# EasyEDA schematic 1-Schematic_Activity_Tracker.json
TITLE: Activity Tracker; REV: 1.0; Date: 2024-11-10; Sheet: 1/1; Drawn By: Nick Jarnot; Company: JarnoTech
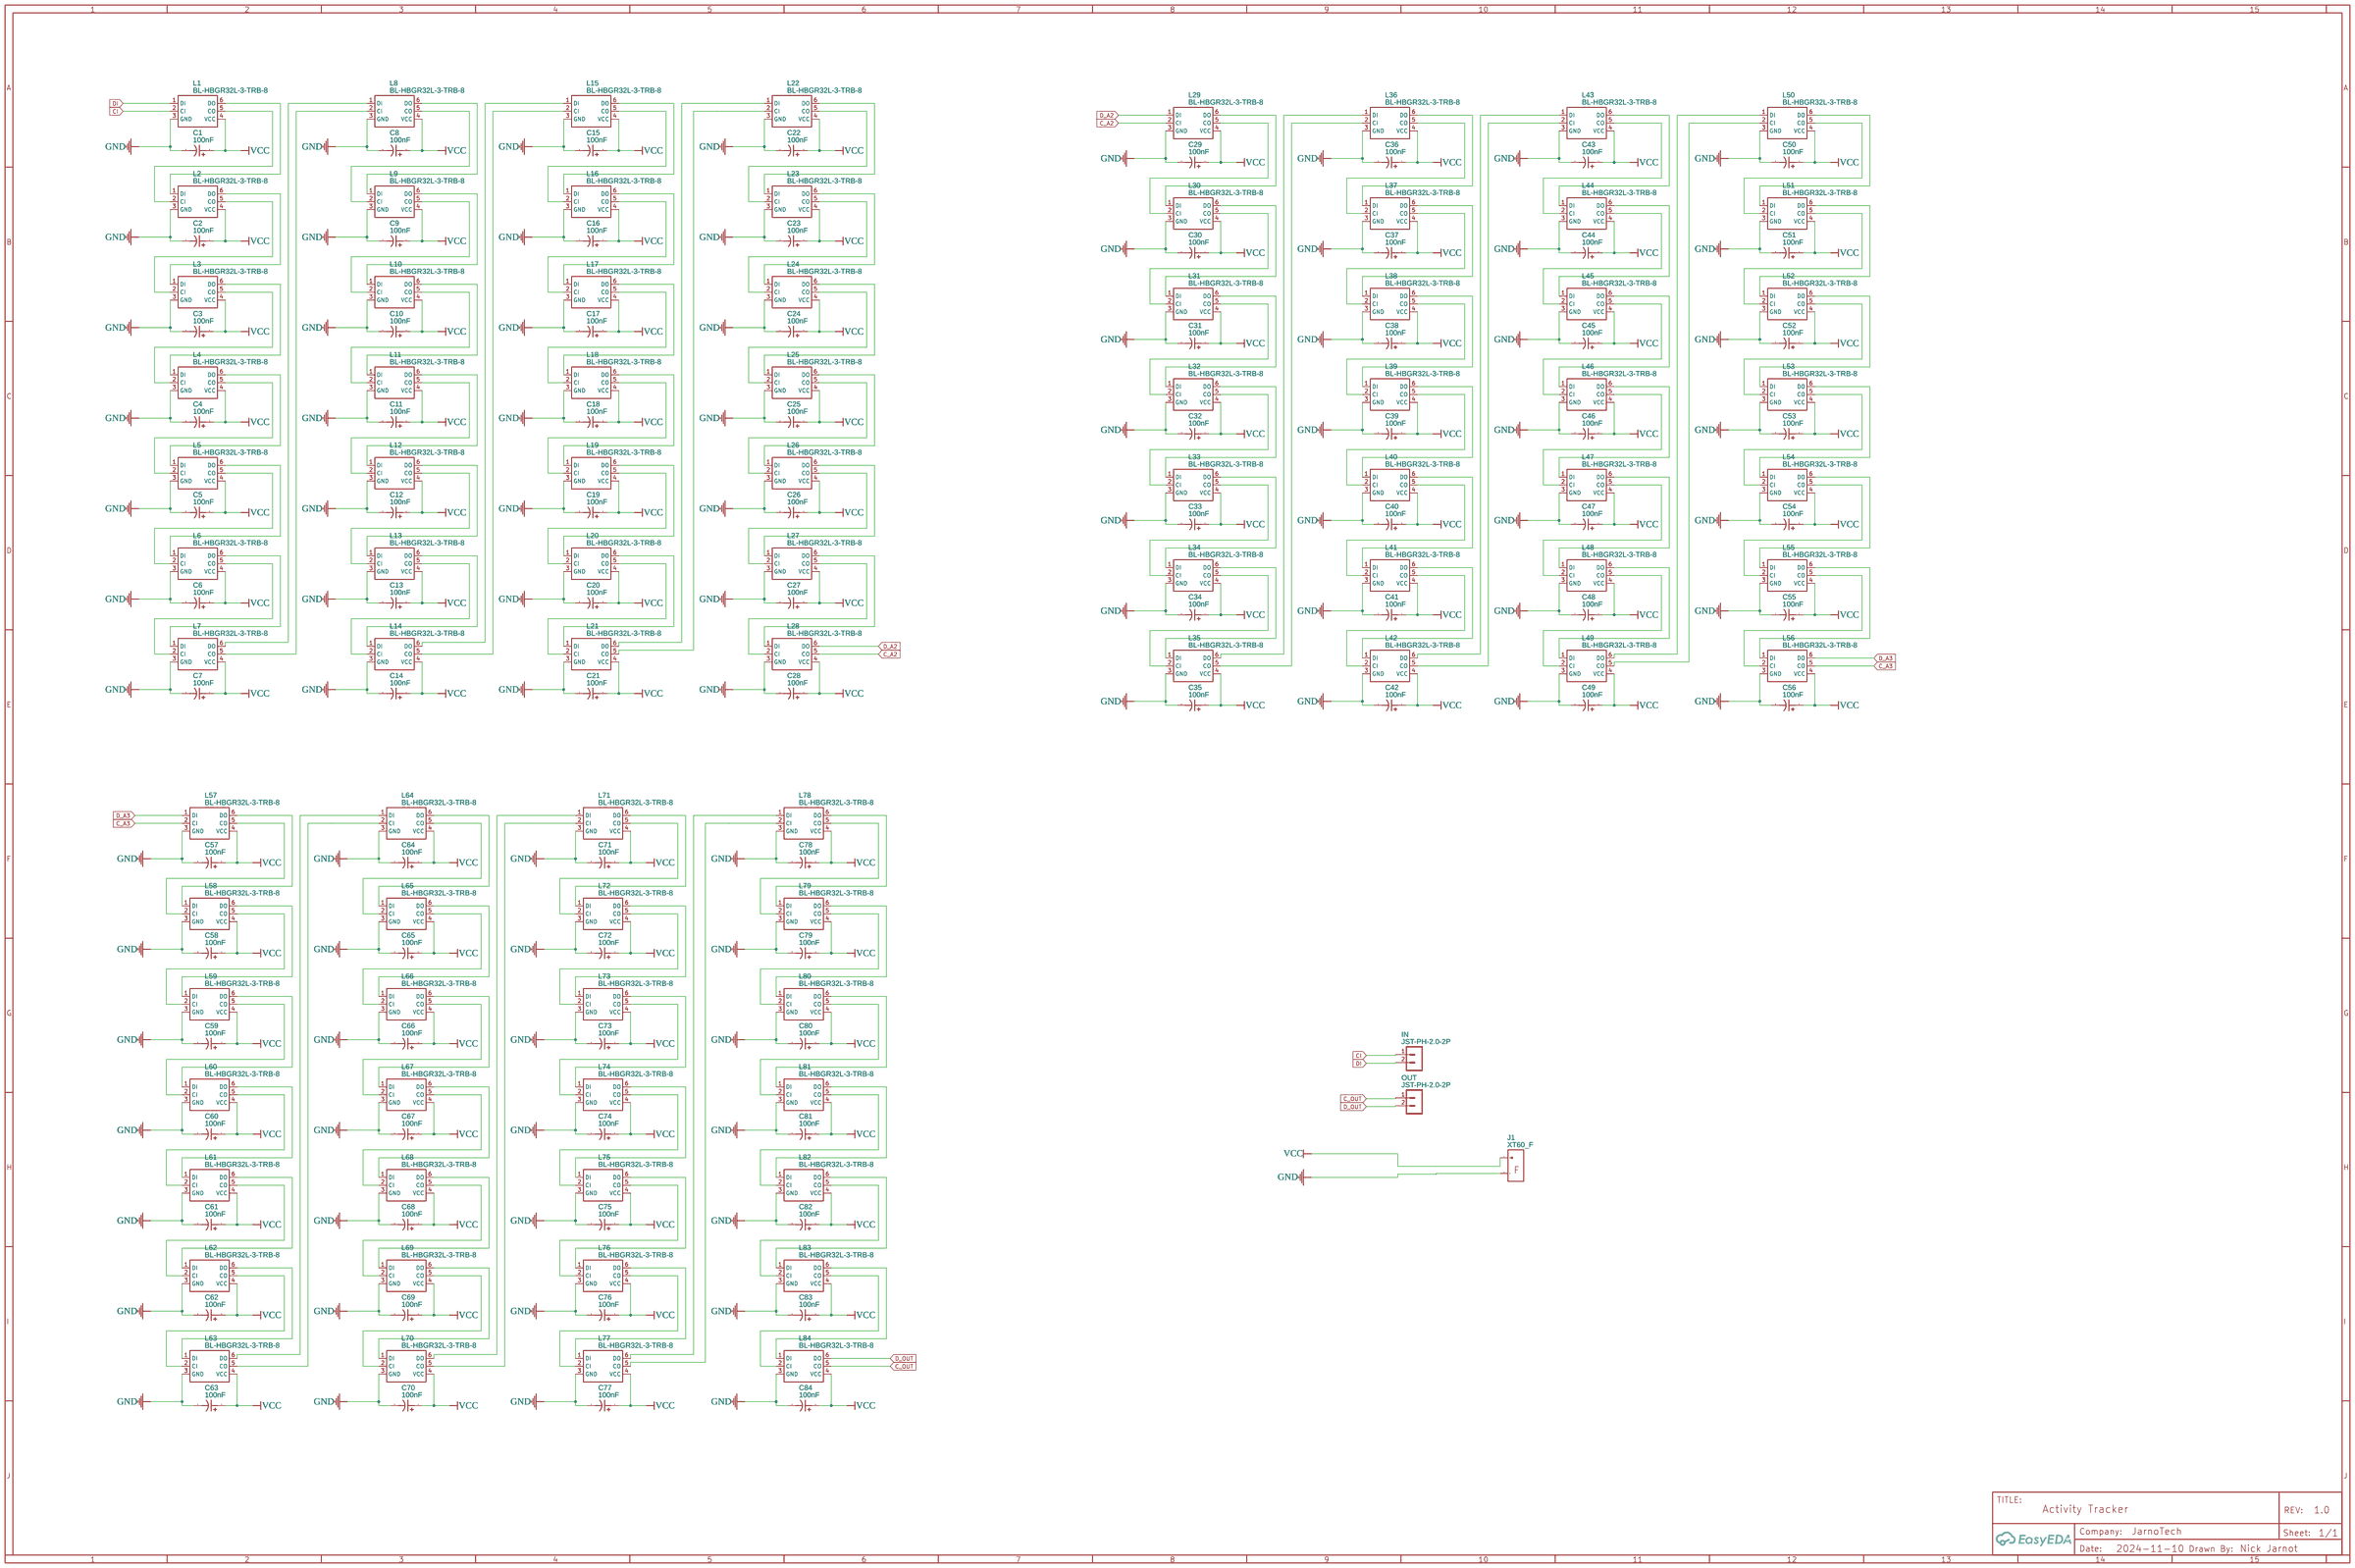
[diagram p0: schematic sheet]

## Parts
C1  100nF  [CAP-SMD_L3.2-W1.6-FD-1]
C2  100nF  [CAP-SMD_L3.2-W1.6-FD-1]
C3  100nF  [CAP-SMD_L3.2-W1.6-FD-1]
C4  100nF  [CAP-SMD_L3.2-W1.6-FD-1]
C5  100nF  [CAP-SMD_L3.2-W1.6-FD-1]
C6  100nF  [CAP-SMD_L3.2-W1.6-FD-1]
C7  100nF  [CAP-SMD_L3.2-W1.6-FD-1]
C8  100nF  [CAP-SMD_L3.2-W1.6-FD-1]
C9  100nF  [CAP-SMD_L3.2-W1.6-FD-1]
C10  100nF  [CAP-SMD_L3.2-W1.6-FD-1]
C11  100nF  [CAP-SMD_L3.2-W1.6-FD-1]
C12  100nF  [CAP-SMD_L3.2-W1.6-FD-1]
C13  100nF  [CAP-SMD_L3.2-W1.6-FD-1]
C14  100nF  [CAP-SMD_L3.2-W1.6-FD-1]
C15  100nF  [CAP-SMD_L3.2-W1.6-FD-1]
C16  100nF  [CAP-SMD_L3.2-W1.6-FD-1]
C17  100nF  [CAP-SMD_L3.2-W1.6-FD-1]
C18  100nF  [CAP-SMD_L3.2-W1.6-FD-1]
C19  100nF  [CAP-SMD_L3.2-W1.6-FD-1]
C20  100nF  [CAP-SMD_L3.2-W1.6-FD-1]
C21  100nF  [CAP-SMD_L3.2-W1.6-FD-1]
C22  100nF  [CAP-SMD_L3.2-W1.6-FD-1]
C23  100nF  [CAP-SMD_L3.2-W1.6-FD-1]
C24  100nF  [CAP-SMD_L3.2-W1.6-FD-1]
C25  100nF  [CAP-SMD_L3.2-W1.6-FD-1]
C26  100nF  [CAP-SMD_L3.2-W1.6-FD-1]
C27  100nF  [CAP-SMD_L3.2-W1.6-FD-1]
C28  100nF  [CAP-SMD_L3.2-W1.6-FD-1]
C29  100nF  [CAP-SMD_L3.2-W1.6-FD-1]
C30  100nF  [CAP-SMD_L3.2-W1.6-FD-1]
C31  100nF  [CAP-SMD_L3.2-W1.6-FD-1]
C32  100nF  [CAP-SMD_L3.2-W1.6-FD-1]
C33  100nF  [CAP-SMD_L3.2-W1.6-FD-1]
C34  100nF  [CAP-SMD_L3.2-W1.6-FD-1]
C35  100nF  [CAP-SMD_L3.2-W1.6-FD-1]
C36  100nF  [CAP-SMD_L3.2-W1.6-FD-1]
C37  100nF  [CAP-SMD_L3.2-W1.6-FD-1]
C38  100nF  [CAP-SMD_L3.2-W1.6-FD-1]
C39  100nF  [CAP-SMD_L3.2-W1.6-FD-1]
C40  100nF  [CAP-SMD_L3.2-W1.6-FD-1]
C41  100nF  [CAP-SMD_L3.2-W1.6-FD-1]
C42  100nF  [CAP-SMD_L3.2-W1.6-FD-1]
C43  100nF  [CAP-SMD_L3.2-W1.6-FD-1]
C44  100nF  [CAP-SMD_L3.2-W1.6-FD-1]
C45  100nF  [CAP-SMD_L3.2-W1.6-FD-1]
C46  100nF  [CAP-SMD_L3.2-W1.6-FD-1]
C47  100nF  [CAP-SMD_L3.2-W1.6-FD-1]
C48  100nF  [CAP-SMD_L3.2-W1.6-FD-1]
C49  100nF  [CAP-SMD_L3.2-W1.6-FD-1]
C50  100nF  [CAP-SMD_L3.2-W1.6-FD-1]
C51  100nF  [CAP-SMD_L3.2-W1.6-FD-1]
C52  100nF  [CAP-SMD_L3.2-W1.6-FD-1]
C53  100nF  [CAP-SMD_L3.2-W1.6-FD-1]
C54  100nF  [CAP-SMD_L3.2-W1.6-FD-1]
C55  100nF  [CAP-SMD_L3.2-W1.6-FD-1]
C56  100nF  [CAP-SMD_L3.2-W1.6-FD-1]
C57  100nF  [CAP-SMD_L3.2-W1.6-FD-1]
C58  100nF  [CAP-SMD_L3.2-W1.6-FD-1]
C59  100nF  [CAP-SMD_L3.2-W1.6-FD-1]
C60  100nF  [CAP-SMD_L3.2-W1.6-FD-1]
C61  100nF  [CAP-SMD_L3.2-W1.6-FD-1]
C62  100nF  [CAP-SMD_L3.2-W1.6-FD-1]
C63  100nF  [CAP-SMD_L3.2-W1.6-FD-1]
C64  100nF  [CAP-SMD_L3.2-W1.6-FD-1]
C65  100nF  [CAP-SMD_L3.2-W1.6-FD-1]
C66  100nF  [CAP-SMD_L3.2-W1.6-FD-1]
C67  100nF  [CAP-SMD_L3.2-W1.6-FD-1]
C68  100nF  [CAP-SMD_L3.2-W1.6-FD-1]
C69  100nF  [CAP-SMD_L3.2-W1.6-FD-1]
C70  100nF  [CAP-SMD_L3.2-W1.6-FD-1]
C71  100nF  [CAP-SMD_L3.2-W1.6-FD-1]
C72  100nF  [CAP-SMD_L3.2-W1.6-FD-1]
C73  100nF  [CAP-SMD_L3.2-W1.6-FD-1]
C74  100nF  [CAP-SMD_L3.2-W1.6-FD-1]
C75  100nF  [CAP-SMD_L3.2-W1.6-FD-1]
C76  100nF  [CAP-SMD_L3.2-W1.6-FD-1]
C77  100nF  [CAP-SMD_L3.2-W1.6-FD-1]
C78  100nF  [CAP-SMD_L3.2-W1.6-FD-1]
C79  100nF  [CAP-SMD_L3.2-W1.6-FD-1]
C80  100nF  [CAP-SMD_L3.2-W1.6-FD-1]
C81  100nF  [CAP-SMD_L3.2-W1.6-FD-1]
C82  100nF  [CAP-SMD_L3.2-W1.6-FD-1]
C83  100nF  [CAP-SMD_L3.2-W1.6-FD-1]
C84  100nF  [CAP-SMD_L3.2-W1.6-FD-1]
IN  JST-PH-2.0-2P  [JST-PH-2.0-2P]
J1  XT60_F  [XT60PW-F]
L1  BL-HBGR32L-3-TRB-8  [BL-HBGR32L-3-TRB-8]
L2  BL-HBGR32L-3-TRB-8  [BL-HBGR32L-3-TRB-8]
L3  BL-HBGR32L-3-TRB-8  [BL-HBGR32L-3-TRB-8]
L4  BL-HBGR32L-3-TRB-8  [BL-HBGR32L-3-TRB-8]
L5  BL-HBGR32L-3-TRB-8  [BL-HBGR32L-3-TRB-8]
L6  BL-HBGR32L-3-TRB-8  [BL-HBGR32L-3-TRB-8]
L7  BL-HBGR32L-3-TRB-8  [BL-HBGR32L-3-TRB-8]
L8  BL-HBGR32L-3-TRB-8  [BL-HBGR32L-3-TRB-8]
L9  BL-HBGR32L-3-TRB-8  [BL-HBGR32L-3-TRB-8]
L10  BL-HBGR32L-3-TRB-8  [BL-HBGR32L-3-TRB-8]
L11  BL-HBGR32L-3-TRB-8  [BL-HBGR32L-3-TRB-8]
L12  BL-HBGR32L-3-TRB-8  [BL-HBGR32L-3-TRB-8]
L13  BL-HBGR32L-3-TRB-8  [BL-HBGR32L-3-TRB-8]
L14  BL-HBGR32L-3-TRB-8  [BL-HBGR32L-3-TRB-8]
L15  BL-HBGR32L-3-TRB-8  [BL-HBGR32L-3-TRB-8]
L16  BL-HBGR32L-3-TRB-8  [BL-HBGR32L-3-TRB-8]
L17  BL-HBGR32L-3-TRB-8  [BL-HBGR32L-3-TRB-8]
L18  BL-HBGR32L-3-TRB-8  [BL-HBGR32L-3-TRB-8]
L19  BL-HBGR32L-3-TRB-8  [BL-HBGR32L-3-TRB-8]
L20  BL-HBGR32L-3-TRB-8  [BL-HBGR32L-3-TRB-8]
L21  BL-HBGR32L-3-TRB-8  [BL-HBGR32L-3-TRB-8]
L22  BL-HBGR32L-3-TRB-8  [BL-HBGR32L-3-TRB-8]
L23  BL-HBGR32L-3-TRB-8  [BL-HBGR32L-3-TRB-8]
L24  BL-HBGR32L-3-TRB-8  [BL-HBGR32L-3-TRB-8]
L25  BL-HBGR32L-3-TRB-8  [BL-HBGR32L-3-TRB-8]
L26  BL-HBGR32L-3-TRB-8  [BL-HBGR32L-3-TRB-8]
L27  BL-HBGR32L-3-TRB-8  [BL-HBGR32L-3-TRB-8]
L28  BL-HBGR32L-3-TRB-8  [BL-HBGR32L-3-TRB-8]
L29  BL-HBGR32L-3-TRB-8  [BL-HBGR32L-3-TRB-8]
L30  BL-HBGR32L-3-TRB-8  [BL-HBGR32L-3-TRB-8]
L31  BL-HBGR32L-3-TRB-8  [BL-HBGR32L-3-TRB-8]
L32  BL-HBGR32L-3-TRB-8  [BL-HBGR32L-3-TRB-8]
L33  BL-HBGR32L-3-TRB-8  [BL-HBGR32L-3-TRB-8]
L34  BL-HBGR32L-3-TRB-8  [BL-HBGR32L-3-TRB-8]
L35  BL-HBGR32L-3-TRB-8  [BL-HBGR32L-3-TRB-8]
L36  BL-HBGR32L-3-TRB-8  [BL-HBGR32L-3-TRB-8]
L37  BL-HBGR32L-3-TRB-8  [BL-HBGR32L-3-TRB-8]
L38  BL-HBGR32L-3-TRB-8  [BL-HBGR32L-3-TRB-8]
L39  BL-HBGR32L-3-TRB-8  [BL-HBGR32L-3-TRB-8]
L40  BL-HBGR32L-3-TRB-8  [BL-HBGR32L-3-TRB-8]
L41  BL-HBGR32L-3-TRB-8  [BL-HBGR32L-3-TRB-8]
L42  BL-HBGR32L-3-TRB-8  [BL-HBGR32L-3-TRB-8]
L43  BL-HBGR32L-3-TRB-8  [BL-HBGR32L-3-TRB-8]
L44  BL-HBGR32L-3-TRB-8  [BL-HBGR32L-3-TRB-8]
L45  BL-HBGR32L-3-TRB-8  [BL-HBGR32L-3-TRB-8]
L46  BL-HBGR32L-3-TRB-8  [BL-HBGR32L-3-TRB-8]
L47  BL-HBGR32L-3-TRB-8  [BL-HBGR32L-3-TRB-8]
L48  BL-HBGR32L-3-TRB-8  [BL-HBGR32L-3-TRB-8]
L49  BL-HBGR32L-3-TRB-8  [BL-HBGR32L-3-TRB-8]
L50  BL-HBGR32L-3-TRB-8  [BL-HBGR32L-3-TRB-8]
L51  BL-HBGR32L-3-TRB-8  [BL-HBGR32L-3-TRB-8]
L52  BL-HBGR32L-3-TRB-8  [BL-HBGR32L-3-TRB-8]
L53  BL-HBGR32L-3-TRB-8  [BL-HBGR32L-3-TRB-8]
L54  BL-HBGR32L-3-TRB-8  [BL-HBGR32L-3-TRB-8]
L55  BL-HBGR32L-3-TRB-8  [BL-HBGR32L-3-TRB-8]
L56  BL-HBGR32L-3-TRB-8  [BL-HBGR32L-3-TRB-8]
L57  BL-HBGR32L-3-TRB-8  [BL-HBGR32L-3-TRB-8]
L58  BL-HBGR32L-3-TRB-8  [BL-HBGR32L-3-TRB-8]
L59  BL-HBGR32L-3-TRB-8  [BL-HBGR32L-3-TRB-8]
L60  BL-HBGR32L-3-TRB-8  [BL-HBGR32L-3-TRB-8]
L61  BL-HBGR32L-3-TRB-8  [BL-HBGR32L-3-TRB-8]
L62  BL-HBGR32L-3-TRB-8  [BL-HBGR32L-3-TRB-8]
L63  BL-HBGR32L-3-TRB-8  [BL-HBGR32L-3-TRB-8]
L64  BL-HBGR32L-3-TRB-8  [BL-HBGR32L-3-TRB-8]
L65  BL-HBGR32L-3-TRB-8  [BL-HBGR32L-3-TRB-8]
L66  BL-HBGR32L-3-TRB-8  [BL-HBGR32L-3-TRB-8]
L67  BL-HBGR32L-3-TRB-8  [BL-HBGR32L-3-TRB-8]
L68  BL-HBGR32L-3-TRB-8  [BL-HBGR32L-3-TRB-8]
L69  BL-HBGR32L-3-TRB-8  [BL-HBGR32L-3-TRB-8]
L70  BL-HBGR32L-3-TRB-8  [BL-HBGR32L-3-TRB-8]
L71  BL-HBGR32L-3-TRB-8  [BL-HBGR32L-3-TRB-8]
L72  BL-HBGR32L-3-TRB-8  [BL-HBGR32L-3-TRB-8]
L73  BL-HBGR32L-3-TRB-8  [BL-HBGR32L-3-TRB-8]
L74  BL-HBGR32L-3-TRB-8  [BL-HBGR32L-3-TRB-8]
L75  BL-HBGR32L-3-TRB-8  [BL-HBGR32L-3-TRB-8]
L76  BL-HBGR32L-3-TRB-8  [BL-HBGR32L-3-TRB-8]
L77  BL-HBGR32L-3-TRB-8  [BL-HBGR32L-3-TRB-8]
L78  BL-HBGR32L-3-TRB-8  [BL-HBGR32L-3-TRB-8]
L79  BL-HBGR32L-3-TRB-8  [BL-HBGR32L-3-TRB-8]
L80  BL-HBGR32L-3-TRB-8  [BL-HBGR32L-3-TRB-8]
L81  BL-HBGR32L-3-TRB-8  [BL-HBGR32L-3-TRB-8]
L82  BL-HBGR32L-3-TRB-8  [BL-HBGR32L-3-TRB-8]
L83  BL-HBGR32L-3-TRB-8  [BL-HBGR32L-3-TRB-8]
L84  BL-HBGR32L-3-TRB-8  [BL-HBGR32L-3-TRB-8]
OUT  JST-PH-2.0-2P  [JST-PH-2.0-2P]

## Library data of the parts
C1-C84 = T491A104K050AT: Supplier: LCSC; Supplier Part: C2798032; Manufacturer: KEMET(基美); JLCPCB Part Class: Extended Part; Contributor: lcsc
IN OUT = JST-PH-2.0-2P: Contributor: tomtony
J1 = XT60_F: Manufacturer: Changzhou Amass Elec; Manufacturer Part: XT60PW-M; Supplier: LCSC; Supplier Part: C98732; link: https://datasheet.lcsc.com/szlcsc/Changzhou-Amass-Elec-XT60PW-M_C98732.pdf; Contributor: Junikos
L1-L84 = BL-HBGR32L-3-TRB-8: Manufacturer: American Bright Optoelectronics Corporation; Supplier: Digi-Key; Supplier Part: 2007-BL-HBGR32L-3-TRB-8DKR-ND - Digi-Reel®; link: https://www.digikey.ca/en/products/detail/american-bright-optoelectronics-corporation/BL-HBGR32L-3-TRB-8/9817409; Contributor: NickWaanders

## Nets
GND: C1.2 C2.2 C3.2 C4.2 C5.2 C6.2 C7.2 C8.2 C9.2 C10.2 C11.2 C12.2 C13.2 C14.2 C15.2 C16.2 C17.2 C18.2 C19.2 C20.2 C21.2 C22.2 C23.2 C24.2 C25.2 C26.2 C27.2 C28.2 C29.2 C30.2 C31.2 C32.2 C33.2 C34.2 C35.2 C36.2 C37.2 C38.2 C39.2 C40.2 C41.2 C42.2 C43.2 C44.2 C45.2 C46.2 C47.2 C48.2 C49.2 C50.2 C51.2 C52.2 C53.2 C54.2 C55.2 C56.2 C57.2 C58.2 C59.2 C60.2 C61.2 C62.2 C63.2 C64.2 C65.2 C66.2 C67.2 C68.2 C69.2 C70.2 C71.2 C72.2 C73.2 C74.2 C75.2 C76.2 C77.2 C78.2 C79.2 C80.2 C81.2 C82.2 C83.2 C84.2 J1.2(GND) L1.3(GND) L2.3(GND) L3.3(GND) L4.3(GND) L5.3(GND) L6.3(GND) L7.3(GND) L8.3(GND) L9.3(GND) L10.3(GND) L11.3(GND) L12.3(GND) L13.3(GND) L14.3(GND) L15.3(GND) L16.3(GND) L17.3(GND) L18.3(GND) L19.3(GND) L20.3(GND) L21.3(GND) L22.3(GND) L23.3(GND) L24.3(GND) L25.3(GND) L26.3(GND) L27.3(GND) L28.3(GND) L29.3(GND) L30.3(GND) L31.3(GND) L32.3(GND) L33.3(GND) L34.3(GND) L35.3(GND) L36.3(GND) L37.3(GND) L38.3(GND) L39.3(GND) L40.3(GND) L41.3(GND) L42.3(GND) L43.3(GND) L44.3(GND) L45.3(GND) L46.3(GND) L47.3(GND) L48.3(GND) L49.3(GND) L50.3(GND) L51.3(GND) L52.3(GND) L53.3(GND) L54.3(GND) L55.3(GND) L56.3(GND) L57.3(GND) L58.3(GND) L59.3(GND) L60.3(GND) L61.3(GND) L62.3(GND) L63.3(GND) L64.3(GND) L65.3(GND) L66.3(GND) L67.3(GND) L68.3(GND) L69.3(GND) L70.3(GND) L71.3(GND) L72.3(GND) L73.3(GND) L74.3(GND) L75.3(GND) L76.3(GND) L77.3(GND) L78.3(GND) L79.3(GND) L80.3(GND) L81.3(GND) L82.3(GND) L83.3(GND) L84.3(GND)
VCC: C1.1 C2.1 C3.1 C4.1 C5.1 C6.1 C7.1 C8.1 C9.1 C10.1 C11.1 C12.1 C13.1 C14.1 C15.1 C16.1 C17.1 C18.1 C19.1 C20.1 C21.1 C22.1 C23.1 C24.1 C25.1 C26.1 C27.1 C28.1 C29.1 C30.1 C31.1 C32.1 C33.1 C34.1 C35.1 C36.1 C37.1 C38.1 C39.1 C40.1 C41.1 C42.1 C43.1 C44.1 C45.1 C46.1 C47.1 C48.1 C49.1 C50.1 C51.1 C52.1 C53.1 C54.1 C55.1 C56.1 C57.1 C58.1 C59.1 C60.1 C61.1 C62.1 C63.1 C64.1 C65.1 C66.1 C67.1 C68.1 C69.1 C70.1 C71.1 C72.1 C73.1 C74.1 C75.1 C76.1 C77.1 C78.1 C79.1 C80.1 C81.1 C82.1 C83.1 C84.1 J1.1(VBAT) L1.4(VCC) L2.4(VCC) L3.4(VCC) L4.4(VCC) L5.4(VCC) L6.4(VCC) L7.4(VCC) L8.4(VCC) L9.4(VCC) L10.4(VCC) L11.4(VCC) L12.4(VCC) L13.4(VCC) L14.4(VCC) L15.4(VCC) L16.4(VCC) L17.4(VCC) L18.4(VCC) L19.4(VCC) L20.4(VCC) L21.4(VCC) L22.4(VCC) L23.4(VCC) L24.4(VCC) L25.4(VCC) L26.4(VCC) L27.4(VCC) L28.4(VCC) L29.4(VCC) L30.4(VCC) L31.4(VCC) L32.4(VCC) L33.4(VCC) L34.4(VCC) L35.4(VCC) L36.4(VCC) L37.4(VCC) L38.4(VCC) L39.4(VCC) L40.4(VCC) L41.4(VCC) L42.4(VCC) L43.4(VCC) L44.4(VCC) L45.4(VCC) L46.4(VCC) L47.4(VCC) L48.4(VCC) L49.4(VCC) L50.4(VCC) L51.4(VCC) L52.4(VCC) L53.4(VCC) L54.4(VCC) L55.4(VCC) L56.4(VCC) L57.4(VCC) L58.4(VCC) L59.4(VCC) L60.4(VCC) L61.4(VCC) L62.4(VCC) L63.4(VCC) L64.4(VCC) L65.4(VCC) L66.4(VCC) L67.4(VCC) L68.4(VCC) L69.4(VCC) L70.4(VCC) L71.4(VCC) L72.4(VCC) L73.4(VCC) L74.4(VCC) L75.4(VCC) L76.4(VCC) L77.4(VCC) L78.4(VCC) L79.4(VCC) L80.4(VCC) L81.4(VCC) L82.4(VCC) L83.4(VCC) L84.4(VCC)
C_A2: L28.5(CO) L29.2(CI)
C_A3: L56.5(CO) L57.2(CI)
C_OUT: L84.5(CO) OUT.1
CI: IN.1 L1.2(CI)
D_A2: L28.6(DO) L29.1(DI)
D_A3: L56.6(DO) L57.1(DI)
D_OUT: L84.6(DO) OUT.2
DI: IN.2 L1.1(DI)
Net-(L1-5): L1.5(CO) L2.2(CI)
Net-(L1-6): L1.6(DO) L2.1(DI)
Net-(L2-5): L2.5(CO) L3.2(CI)
Net-(L2-6): L2.6(DO) L3.1(DI)
Net-(L3-5): L3.5(CO) L4.2(CI)
Net-(L3-6): L3.6(DO) L4.1(DI)
Net-(L4-5): L4.5(CO) L5.2(CI)
Net-(L4-6): L4.6(DO) L5.1(DI)
Net-(L5-5): L5.5(CO) L6.2(CI)
Net-(L5-6): L5.6(DO) L6.1(DI)
Net-(L6-5): L6.5(CO) L7.2(CI)
Net-(L6-6): L6.6(DO) L7.1(DI)
Net-(L7-5): L7.5(CO) L8.2(CI)
Net-(L7-6): L7.6(DO) L8.1(DI)
Net-(L8-5): L8.5(CO) L9.2(CI)
Net-(L8-6): L8.6(DO) L9.1(DI)
Net-(L9-5): L9.5(CO) L10.2(CI)
Net-(L9-6): L9.6(DO) L10.1(DI)
Net-(L10-5): L10.5(CO) L11.2(CI)
Net-(L10-6): L10.6(DO) L11.1(DI)
Net-(L11-5): L11.5(CO) L12.2(CI)
Net-(L11-6): L11.6(DO) L12.1(DI)
Net-(L12-5): L12.5(CO) L13.2(CI)
Net-(L12-6): L12.6(DO) L13.1(DI)
Net-(L13-5): L13.5(CO) L14.2(CI)
Net-(L13-6): L13.6(DO) L14.1(DI)
Net-(L14-5): L14.5(CO) L15.2(CI)
Net-(L14-6): L14.6(DO) L15.1(DI)
Net-(L15-5): L15.5(CO) L16.2(CI)
Net-(L15-6): L15.6(DO) L16.1(DI)
Net-(L16-5): L16.5(CO) L17.2(CI)
Net-(L16-6): L16.6(DO) L17.1(DI)
Net-(L17-5): L17.5(CO) L18.2(CI)
Net-(L17-6): L17.6(DO) L18.1(DI)
Net-(L18-5): L18.5(CO) L19.2(CI)
Net-(L18-6): L18.6(DO) L19.1(DI)
Net-(L19-5): L19.5(CO) L20.2(CI)
Net-(L19-6): L19.6(DO) L20.1(DI)
Net-(L20-5): L20.5(CO) L21.2(CI)
Net-(L20-6): L20.6(DO) L21.1(DI)
Net-(L21-5): L21.5(CO) L22.2(CI)
Net-(L21-6): L21.6(DO) L22.1(DI)
Net-(L22-5): L22.5(CO) L23.2(CI)
Net-(L22-6): L22.6(DO) L23.1(DI)
Net-(L23-5): L23.5(CO) L24.2(CI)
Net-(L23-6): L23.6(DO) L24.1(DI)
Net-(L24-5): L24.5(CO) L25.2(CI)
Net-(L24-6): L24.6(DO) L25.1(DI)
Net-(L25-5): L25.5(CO) L26.2(CI)
Net-(L25-6): L25.6(DO) L26.1(DI)
Net-(L26-5): L26.5(CO) L27.2(CI)
Net-(L26-6): L26.6(DO) L27.1(DI)
Net-(L27-5): L27.5(CO) L28.2(CI)
Net-(L27-6): L27.6(DO) L28.1(DI)
Net-(L29-5): L29.5(CO) L30.2(CI)
Net-(L29-6): L29.6(DO) L30.1(DI)
Net-(L30-5): L30.5(CO) L31.2(CI)
Net-(L30-6): L30.6(DO) L31.1(DI)
Net-(L31-5): L31.5(CO) L32.2(CI)
Net-(L31-6): L31.6(DO) L32.1(DI)
Net-(L32-5): L32.5(CO) L33.2(CI)
Net-(L32-6): L32.6(DO) L33.1(DI)
Net-(L33-5): L33.5(CO) L34.2(CI)
Net-(L33-6): L33.6(DO) L34.1(DI)
Net-(L34-5): L34.5(CO) L35.2(CI)
Net-(L34-6): L34.6(DO) L35.1(DI)
Net-(L35-5): L35.5(CO) L36.2(CI)
Net-(L35-6): L35.6(DO) L36.1(DI)
Net-(L36-5): L36.5(CO) L37.2(CI)
Net-(L36-6): L36.6(DO) L37.1(DI)
Net-(L37-5): L37.5(CO) L38.2(CI)
Net-(L37-6): L37.6(DO) L38.1(DI)
Net-(L38-5): L38.5(CO) L39.2(CI)
Net-(L38-6): L38.6(DO) L39.1(DI)
Net-(L39-5): L39.5(CO) L40.2(CI)
Net-(L39-6): L39.6(DO) L40.1(DI)
Net-(L40-5): L40.5(CO) L41.2(CI)
Net-(L40-6): L40.6(DO) L41.1(DI)
Net-(L41-5): L41.5(CO) L42.2(CI)
Net-(L41-6): L41.6(DO) L42.1(DI)
Net-(L42-5): L42.5(CO) L43.2(CI)
Net-(L42-6): L42.6(DO) L43.1(DI)
Net-(L43-5): L43.5(CO) L44.2(CI)
Net-(L43-6): L43.6(DO) L44.1(DI)
Net-(L44-5): L44.5(CO) L45.2(CI)
Net-(L44-6): L44.6(DO) L45.1(DI)
Net-(L45-5): L45.5(CO) L46.2(CI)
Net-(L45-6): L45.6(DO) L46.1(DI)
Net-(L46-5): L46.5(CO) L47.2(CI)
Net-(L46-6): L46.6(DO) L47.1(DI)
Net-(L47-5): L47.5(CO) L48.2(CI)
Net-(L47-6): L47.6(DO) L48.1(DI)
Net-(L48-5): L48.5(CO) L49.2(CI)
Net-(L48-6): L48.6(DO) L49.1(DI)
Net-(L49-5): L49.5(CO) L50.2(CI)
Net-(L49-6): L49.6(DO) L50.1(DI)
Net-(L50-5): L50.5(CO) L51.2(CI)
Net-(L50-6): L50.6(DO) L51.1(DI)
Net-(L51-5): L51.5(CO) L52.2(CI)
Net-(L51-6): L51.6(DO) L52.1(DI)
Net-(L52-5): L52.5(CO) L53.2(CI)
Net-(L52-6): L52.6(DO) L53.1(DI)
Net-(L53-5): L53.5(CO) L54.2(CI)
Net-(L53-6): L53.6(DO) L54.1(DI)
Net-(L54-5): L54.5(CO) L55.2(CI)
Net-(L54-6): L54.6(DO) L55.1(DI)
Net-(L55-5): L55.5(CO) L56.2(CI)
Net-(L55-6): L55.6(DO) L56.1(DI)
Net-(L57-5): L57.5(CO) L58.2(CI)
Net-(L57-6): L57.6(DO) L58.1(DI)
Net-(L58-5): L58.5(CO) L59.2(CI)
Net-(L58-6): L58.6(DO) L59.1(DI)
Net-(L59-5): L59.5(CO) L60.2(CI)
Net-(L59-6): L59.6(DO) L60.1(DI)
Net-(L60-5): L60.5(CO) L61.2(CI)
Net-(L60-6): L60.6(DO) L61.1(DI)
Net-(L61-5): L61.5(CO) L62.2(CI)
Net-(L61-6): L61.6(DO) L62.1(DI)
Net-(L62-5): L62.5(CO) L63.2(CI)
Net-(L62-6): L62.6(DO) L63.1(DI)
Net-(L63-5): L63.5(CO) L64.2(CI)
Net-(L63-6): L63.6(DO) L64.1(DI)
Net-(L64-5): L64.5(CO) L65.2(CI)
Net-(L64-6): L64.6(DO) L65.1(DI)
Net-(L65-5): L65.5(CO) L66.2(CI)
Net-(L65-6): L65.6(DO) L66.1(DI)
Net-(L66-5): L66.5(CO) L67.2(CI)
Net-(L66-6): L66.6(DO) L67.1(DI)
Net-(L67-5): L67.5(CO) L68.2(CI)
Net-(L67-6): L67.6(DO) L68.1(DI)
Net-(L68-5): L68.5(CO) L69.2(CI)
Net-(L68-6): L68.6(DO) L69.1(DI)
Net-(L69-5): L69.5(CO) L70.2(CI)
Net-(L69-6): L69.6(DO) L70.1(DI)
Net-(L70-5): L70.5(CO) L71.2(CI)
Net-(L70-6): L70.6(DO) L71.1(DI)
Net-(L71-5): L71.5(CO) L72.2(CI)
Net-(L71-6): L71.6(DO) L72.1(DI)
Net-(L72-5): L72.5(CO) L73.2(CI)
Net-(L72-6): L72.6(DO) L73.1(DI)
Net-(L73-5): L73.5(CO) L74.2(CI)
Net-(L73-6): L73.6(DO) L74.1(DI)
Net-(L74-5): L74.5(CO) L75.2(CI)
Net-(L74-6): L74.6(DO) L75.1(DI)
Net-(L75-5): L75.5(CO) L76.2(CI)
Net-(L75-6): L75.6(DO) L76.1(DI)
Net-(L76-5): L76.5(CO) L77.2(CI)
Net-(L76-6): L76.6(DO) L77.1(DI)
Net-(L77-5): L77.5(CO) L78.2(CI)
Net-(L77-6): L77.6(DO) L78.1(DI)
Net-(L78-5): L78.5(CO) L79.2(CI)
Net-(L78-6): L78.6(DO) L79.1(DI)
Net-(L79-5): L79.5(CO) L80.2(CI)
Net-(L79-6): L79.6(DO) L80.1(DI)
Net-(L80-5): L80.5(CO) L81.2(CI)
Net-(L80-6): L80.6(DO) L81.1(DI)
Net-(L81-5): L81.5(CO) L82.2(CI)
Net-(L81-6): L81.6(DO) L82.1(DI)
Net-(L82-5): L82.5(CO) L83.2(CI)
Net-(L82-6): L82.6(DO) L83.1(DI)
Net-(L83-5): L83.5(CO) L84.2(CI)
Net-(L83-6): L83.6(DO) L84.1(DI)
